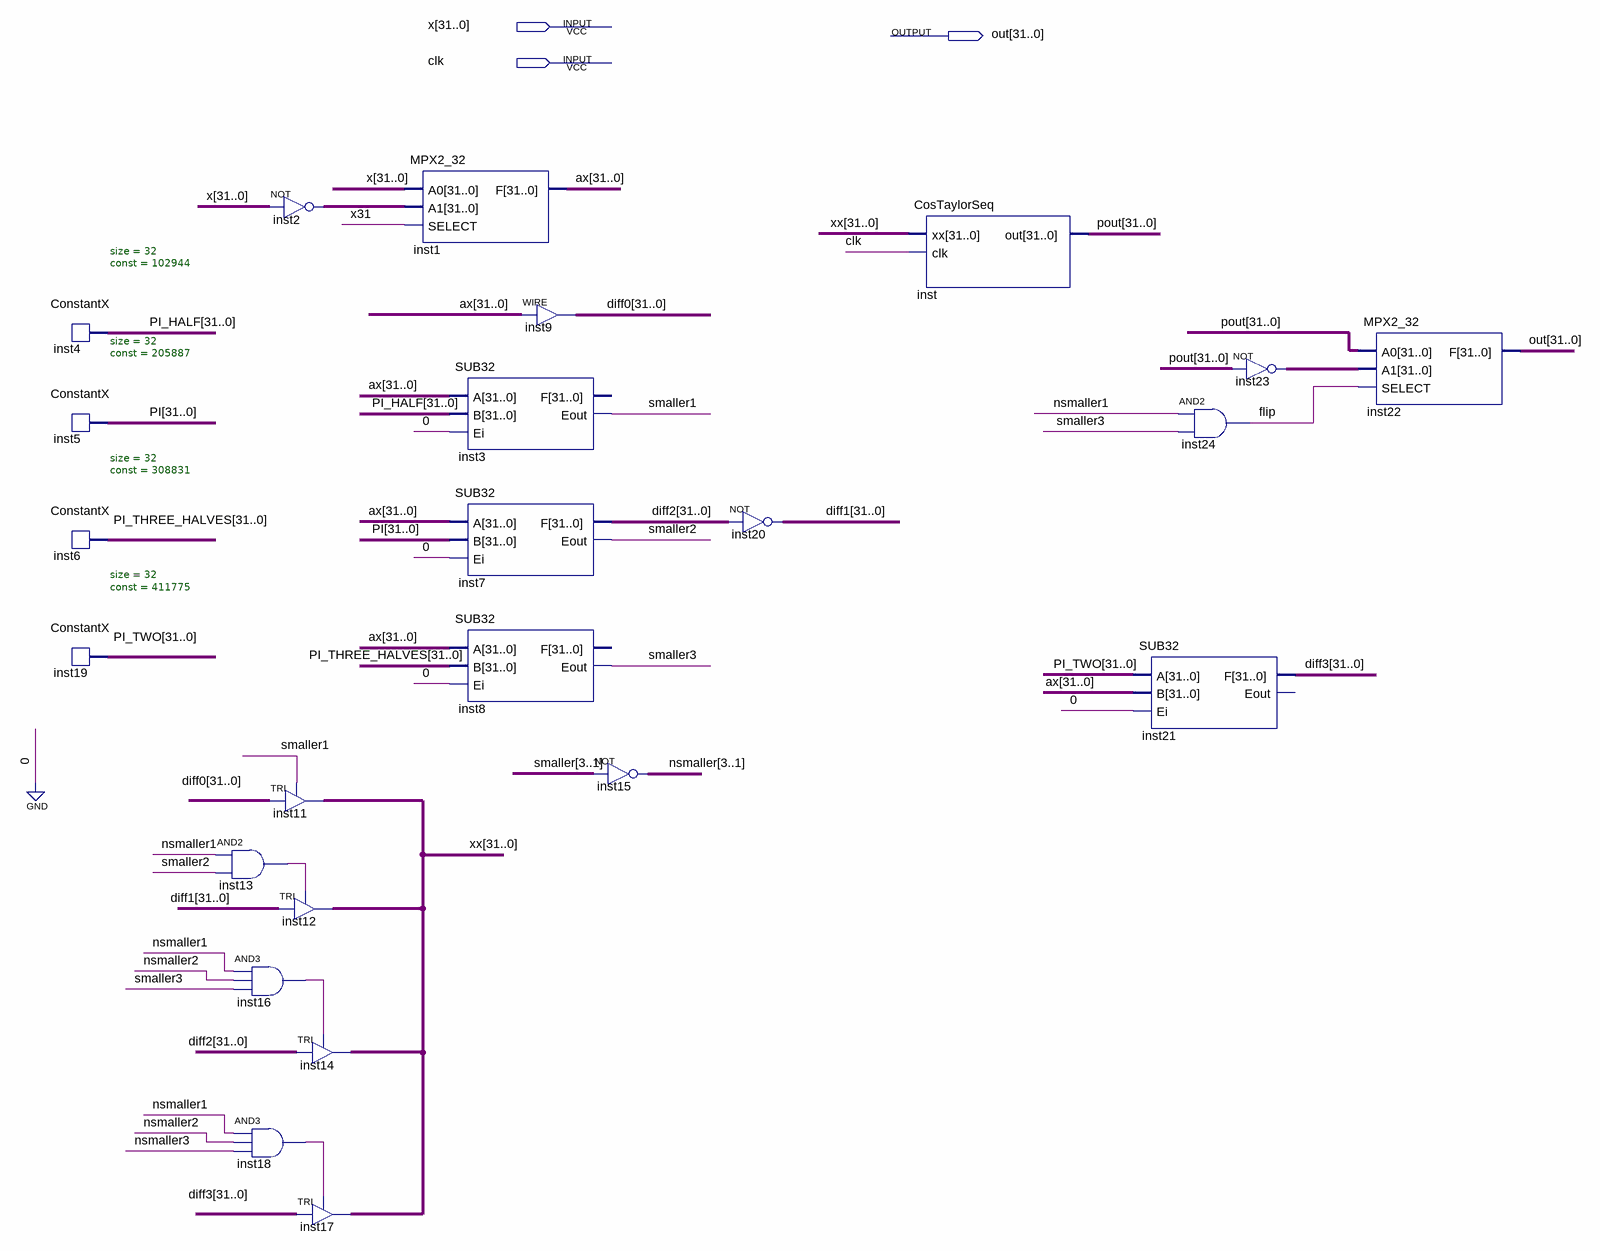
[diagram p0: schematic sheet]
// Quartus schematic CosSeq.bdf as structural Verilog: 24 symbols, 3 pins
module CosSeq (
  input  [31:0] x,
  input  clk,
  output [31:0] out
);

  wire flip, inst13_out, inst16_out, inst18_out;
  wire [3:1] nsmaller, smaller;
  wire [31:0] ax, diff0, diff1, diff2, diff3, inst2_out, inst23_out, PI, PI_HALF, PI_THREE_HALVES, PI_TWO,
       pout, xx;

  ConstantX #(.size(32), .\const (102944)) inst4 (.DATA_OUT(PI_HALF));
  ConstantX #(.size(32), .\const (205887)) inst5 (.DATA_OUT(PI));
  ConstantX #(.size(32), .\const (308831)) inst6 (.DATA_OUT(PI_THREE_HALVES));
  ConstantX #(.size(32), .\const (411775)) inst19 (.DATA_OUT(PI_TWO));
  assign inst2_out = ~x;  // NOT inst2, 32 bits wide
  TRI inst11[31:0] (.IN(diff0), .OE(smaller[1]), .OUT(xx));
  and inst13 (inst13_out, nsmaller[1], smaller[2]);
  and inst16 (inst16_out, nsmaller[1], nsmaller[2], smaller[3]);
  and inst18 (inst18_out, nsmaller[1], nsmaller[2], nsmaller[3]);
  TRI inst12[31:0] (.IN(diff1), .OE(inst13_out), .OUT(xx));
  TRI inst14[31:0] (.IN(diff2), .OE(inst16_out), .OUT(xx));
  TRI inst17[31:0] (.IN(diff3), .OE(inst18_out), .OUT(xx));
  MPX2_32 inst1 (.A0(x), .A1(inst2_out), .SELECT(x[31]), .F(ax));
  SUB32 inst3 (.A(ax), .B(PI_HALF), .Ei(1'b0), .Eout(smaller[1]));  // open: F
  SUB32 inst7 (.A(ax), .B(PI), .Ei(1'b0), .F(diff2), .Eout(smaller[2]));
  SUB32 inst8 (.A(ax), .B(PI_THREE_HALVES), .Ei(1'b0), .Eout(smaller[3]));  // open: F
  assign diff0 = ax;  // WIRE inst9
  assign nsmaller = ~smaller;  // NOT inst15, 3 bits wide
  assign diff1 = ~diff2;  // NOT inst20, 32 bits wide
  CosTaylorSeq inst (.xx(xx), .clk(clk), .out(pout));
  SUB32 inst21 (.A(PI_TWO), .B(ax), .Ei(1'b0), .F(diff3));  // open: Eout
  and inst24 (flip, nsmaller[1], smaller[3]);
  assign inst23_out = ~pout;  // NOT inst23, 32 bits wide
  MPX2_32 inst22 (.A0(pout), .A1(inst23_out), .SELECT(flip), .F(out));
endmodule
